# EAGLE design multi-pcb-cruisecontrol (EAGLE 9.6.2)
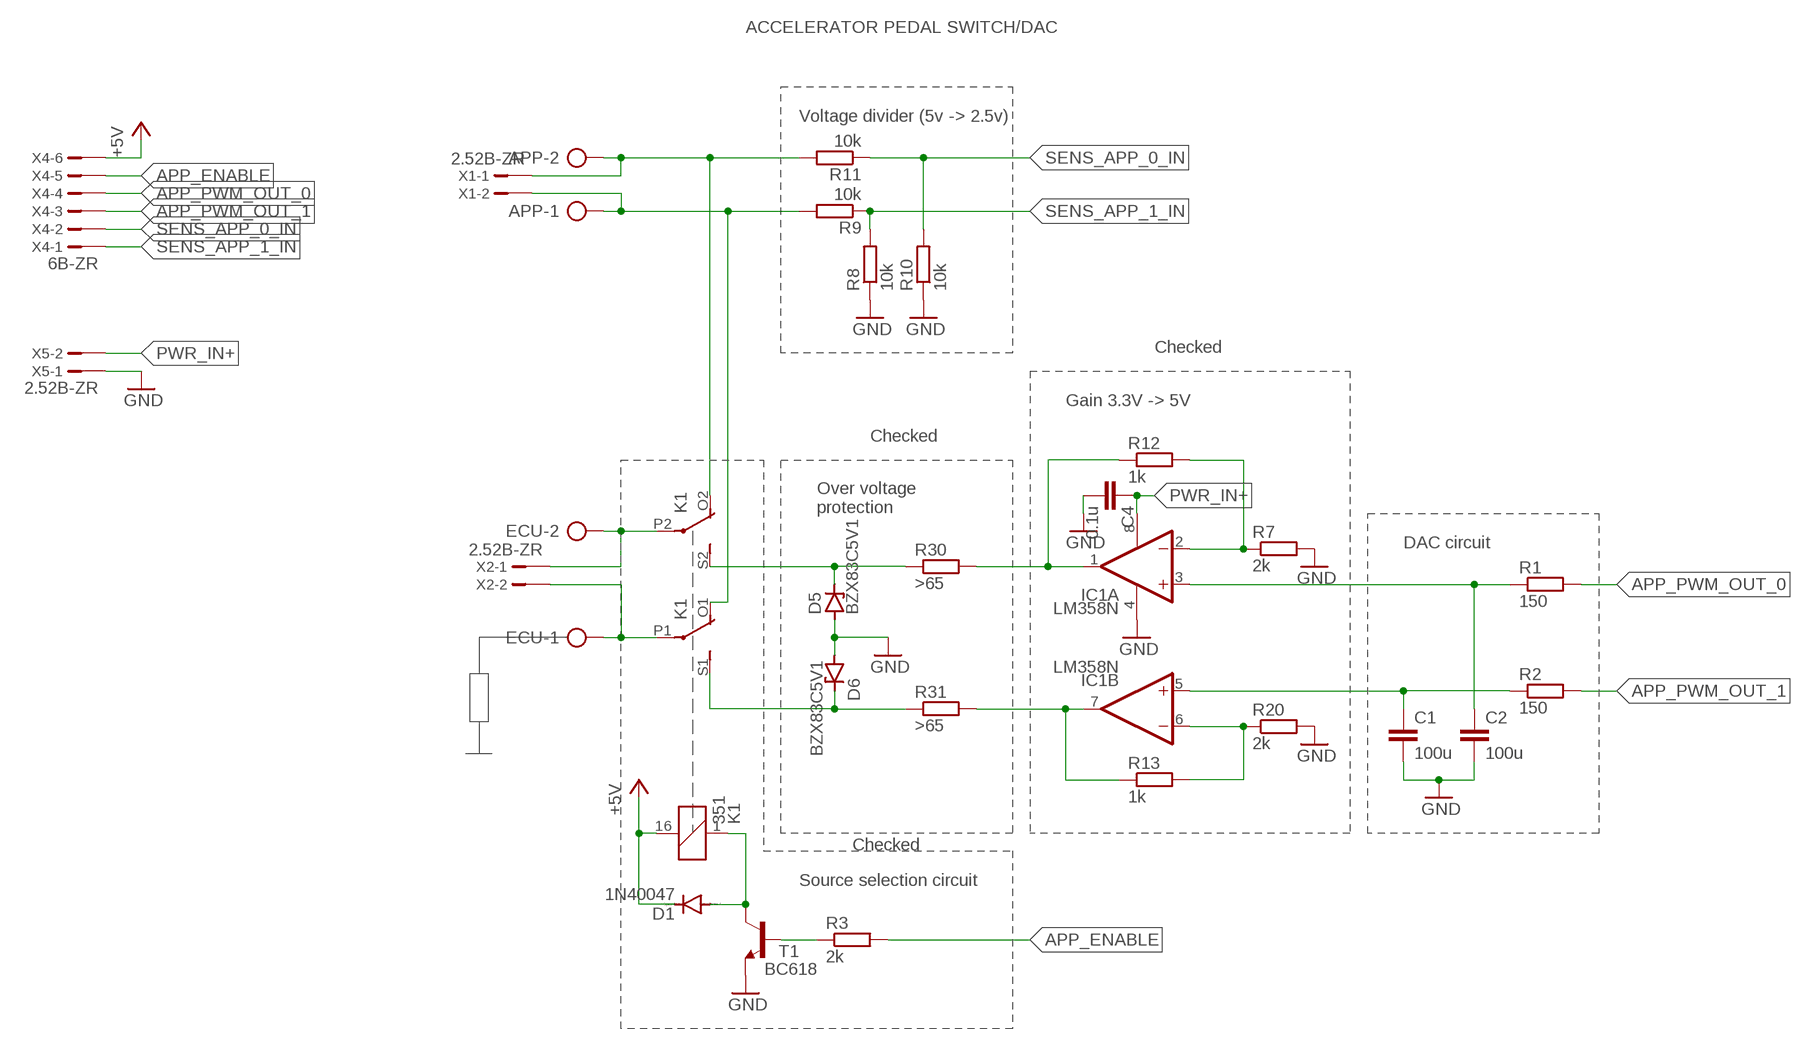
[diagram p0: schematic, sheet 1]

## Parts
APP  AK300/2  [AK300/2]
C1  100u  C-EU025-050X050  [C025-050X050]
C2  100u  C-EU025-050X050  [C025-050X050]
C4  0.1u  C-EU025-050X050  [C025-050X050]
D1  1N40047  [DO41-7.6]
D5  BZX83C5V1  BZX857  [DO41Z7.6]
D6  BZX83C5V1  BZX857  [DO41Z7.6]
ECU  AK300/2  [AK300/2]
IC1  LM358N  [DIL08]
K1  351  [351]
R1  150  R-EU_0207/7  [0207/7]
R2  150  R-EU_0207/7  [0207/7]
R3  2k  R-EU_0207/7  [0207/7]
R7  2k  R-EU_0207/7  [0207/7]
R8  10k  R-EU_0207/7  [0207/7]
R9  10k  R-EU_0207/7  [0207/7]
R10  10k  R-EU_0207/7  [0207/7]
R11  10k  R-EU_0207/7  [0207/7]
R12  1k  R-EU_0207/7  [0207/7]
R13  1k  R-EU_0207/7  [0207/7]
R20  2k  R-EU_0207/7  [0207/7]
R30  >65  R-EU_0207/7  [0207/7]
R31  >65  R-EU_0207/7  [0207/7]
T1  BC618  [TO92-EBC]
X1  2.52B-ZR  [B2B-ZR2.5]
X2  2.52B-ZR  [B2B-ZR2.5]
X4  6B-ZR  [B6B-ZR2.5]
X5  2.52B-ZR  [B2B-ZR2.5]

## Nets
+5V: D1.C K1.16 X4.6
APP_0_IN: APP.2 K1.O2(3:O) R11.2 X1.1
APP_1_IN: APP.1 K1.O1(2:O) R9.2 X1.2
APP_ENABLE: R3.2 X4.5
APP_PWM_OUT_0: R1.2 X4.4
APP_PWM_OUT_1: R2.2 X4.3
GND: C1.2 C2.2 C4.2 D5.A D6.A IC1.4(P:V-) R7.2 R8.1 R10.1 R20.2 T1.E X5.1
N$1: D1.A K1.1 T1.C
N$2: R3.1 T1.B
N$3: D6.C K1.S1(2:S) R31.1
N$4: IC1.1(A:OUT) R12.1 R30.2
N$6: ECU.2 K1.P2(3:P) X2.1
N$7: ECU.1 K1.P1(2:P) X2.2
N$8: C2.1 IC1.3(A:+IN) R1.1
N$9: C1.1 IC1.5(B:+IN) R2.1
N$13: IC1.2(A:-IN) R7.1 R12.2
N$16: IC1.6(B:-IN) R13.2 R20.1
N$17: D5.C K1.S2(3:S) R30.1
N$18: IC1.7(B:OUT) R13.1 R31.2
PWR_IN+: C4.1 IC1.8(P:V+) X5.2
SENS_APP_0_IN: R10.2 R11.1 X4.2
SENS_APP_1_IN: R8.2 R9.1 X4.1

## Notes on the sheet
- ACCELERATOR PEDAL SWITCH/DAC
- Voltage divider (5v -> 2.5v)
- Checked
- Gain 3.3V -> 5V
- Checked
- Over voltage
  protection
- DAC circuit
- Checked
- Source selection circuit

## Library data of the parts
APP ECU = con-ptr500-custom:AK300/2: CONNECTOR; OC_FARNELL: unknown; OC_NEWARK: unknown
C1 C2 C4 = rcl:C-EU: CAPACITOR, European symbol; SPICEPREFIX: C
D1 = diode-custom:1N4004: DIODE general purpose rectifier, 1 A
D5 D6 = diode-custom:BZX85: Z DIODE
IC1 = linear:LM358: OP AMP also LM158; LM258; LM2904 Source: http://cache.national.com/ds/LM/LM158.pdf
K1 = relay:351: RELAY 2 x switch, Omron; OC_FARNELL: unknown; OC_NEWARK: unknown
R1-R3 R7-R13 R20 R30 R31 = rcl:R-EU_: RESISTOR, European symbol; SPICEPREFIX: R
T1 = transistor-npn:BC618*: NPN Transistor
X1 X2 X5 = con-jst-custom:?2B-ZR: ZH CONNECTOR 1.5 mm, 4 pin 1 row Source: http://www.jst.com .. eZH.pdf
X4 = con-jst-custom:?6B-ZR: ZH CONNECTOR 1.5 mm, 4 pin 1 row Source: http://www.jst.com .. eZH.pdf

## Board
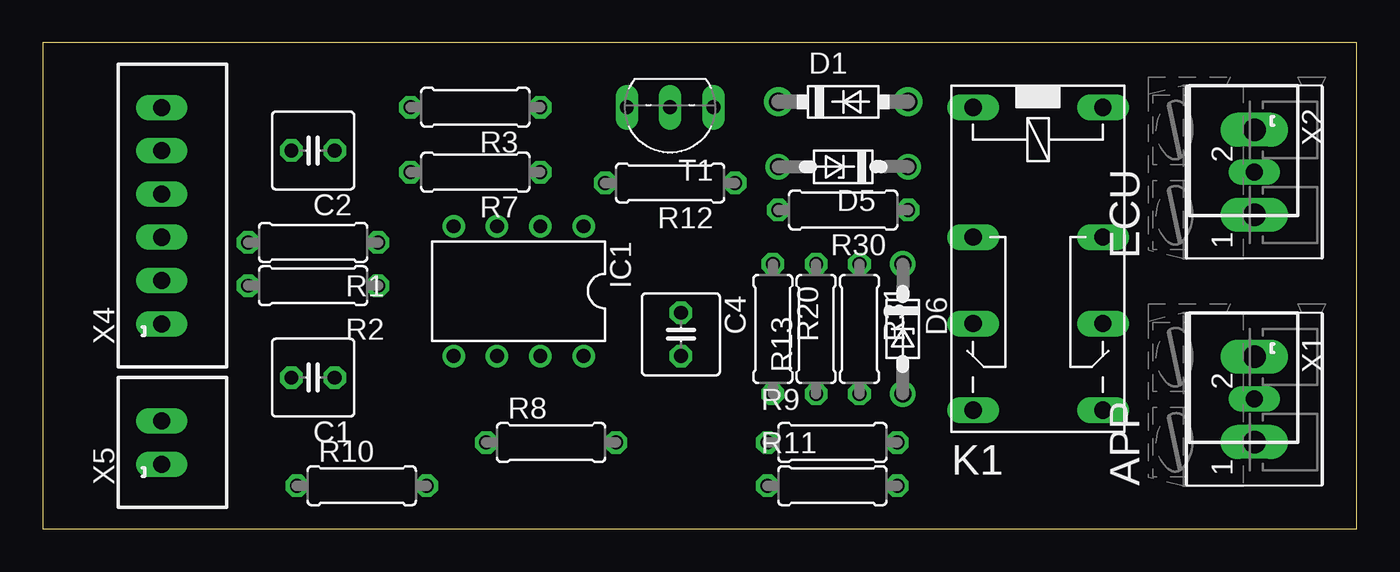
[diagram p1: board, top side]
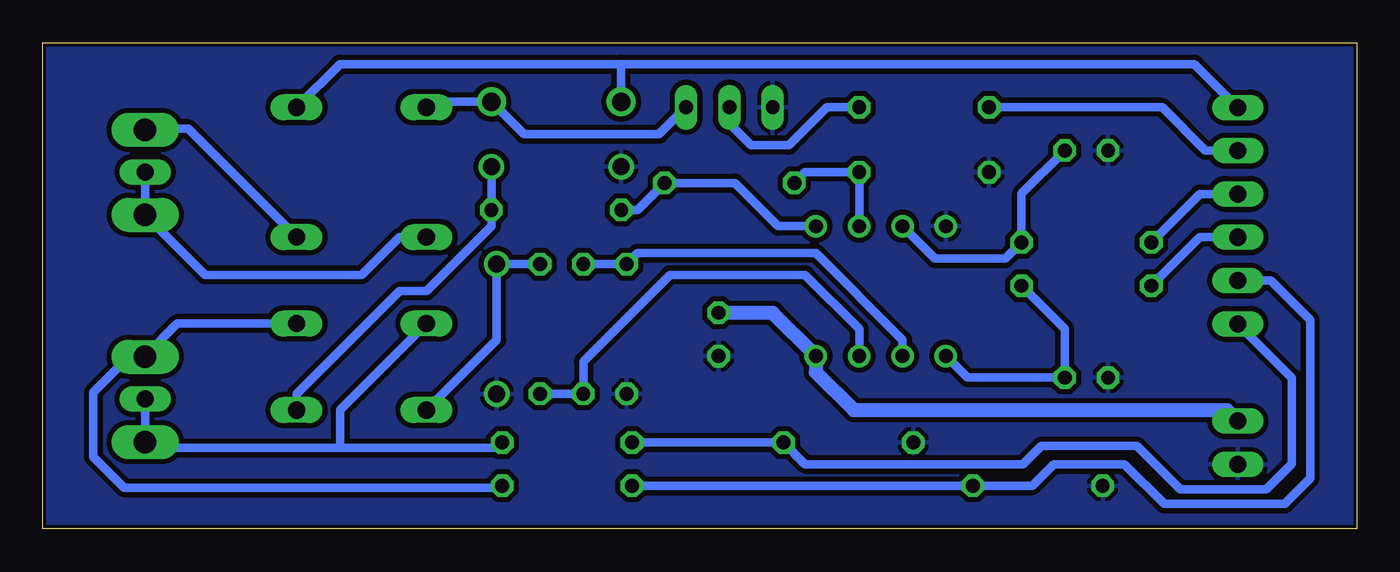
[diagram p2: board, bottom side, seen from below]

Size 77.14 x 28.57 mm. Coordinates in mm from the lower left corner, seen from the top.
Outline: 0,0 77.14,0 77.14,28.57 0,28.57 0,0
Copper layers (1*16): Top 0.035mm / dielectric 1.5mm / Bottom 0.035mm
Design rules "home-made-pcb": minimum track width 8mil, minimum drill 0.3mm, track to track 12mil, track to pad 8mil, pad to pad 10mil, via to via 10mil, smd to smd 6mil, copper to edge 8mil, drill to drill 10mil, minimum pad ring 10mil, minimum via ring 20mil, stop-mask expansion 4mil, vias tented up to drill 0mil, thermal gap 10mil

### Footprints (pad centres in the part's own frame; a part is rotated, then mirrored left to right if it is on the bottom)
AK300/2 = drill 1.321 long: 1 -2.515,0; 2 2.489,0
C025-050X050 = drill 0.813 octagon: 1 -1.27,0; 2 1.27,0
DO41-7.6 = drill 1.1 pad 1.7: A 3.81,0; C -3.81,0
DO41Z7.6 = drill 1: A 3.81,0; C -3.81,0
DIL08 = drill 0.813 pad 1.27: 1 -3.81,-3.81; 2 -1.27,-3.81; 3 1.27,-3.81; 4 3.81,-3.81; 5 3.81,3.81; 6 1.27,3.81; 7 -1.27,3.81; 8 -3.81,3.81
351 = drill 1.016 long: 1 -3.81,-3.81; 16 -3.81,3.81; O1 8.89,-3.81; O2 8.89,3.81; P1 3.81,-3.81; P2 3.81,3.81; S1 13.97,-3.81; S2 13.97,3.81
0207/7 = drill 0.813 octagon: 1 -3.81,0; 2 3.81,0
TO92-EBC = drill 0.813 long: B 0,-1.27; C -2.54,-1.27; E 2.54,-1.27
B2B-ZR2.5 = drill 1 pad 1.422 long: 1 -1.285,0; 2 1.257,0
B6B-ZR2.5 = drill 1 pad 1.422 long: 1 -6.365,0; 2 -3.823,0; 3 -1.283,0; 4 1.257,0; 5 3.797,0; 6 6.337,0

### Placement (x,y rotation side)
APP  71.12,7.62 90 top
C1  15.88,8.89 180 top
C2  15.88,22.23 180 top
C4  37.47,11.43 270 top
D1  46.99,25.08 0 top
D5  46.99,21.27 180 top
D6  50.48,11.75 270 top
ECU  71.12,20.95 90 top
IC1  27.94,13.97 180 top
K1  58.42,20.95 270 top
R1  15.88,16.83 180 top
R2  15.88,14.29 180 top
R3  25.4,24.77 180 top
R7  25.4,20.95 180 top
R8  29.84,5.08 0 top
R9  46.35,5.08 0 top
R10  18.73,2.54 0 top
R11  46.35,2.54 0 top
R12  36.83,20.32 180 top
R13  45.4,11.75 90 top
R20  42.86,11.75 270 top
R30  46.99,18.73 180 top
R31  47.94,11.75 270 top
T1  36.83,23.5 180 top
X1  71.12,8.89 270 top
X2  71.12,22.23 270 top
X4  6.99,18.41 90 top
X5  6.99,5.08 90 top

### Tracks (layer width: path | path; a pad name or v marks a point on that pad's centre or on a via)
+5V
  Bottom 0.508: K1.16 59.69,27.3 43.18,27.3 | X4.6 9.54,27.3 43.18,27.3 | D1.C 43.18,27.3
APP_0_IN
  Bottom 0.508: R11.2 50.28,2.43 72.35,2.43 74.17,4.24 74.17,8.01 72.07,10.11 APP.2 X1.1 69.23,12.06 K1.O2
APP_1_IN
  Bottom 0.508: X1.2 APP.1 70.78,4.76 59.69,4.76 | R9.2 50.48,4.76 59.69,4.76 | K1.O1 59.69,6.99 59.69,4.76
APP_ENABLE
  Bottom 0.508: X4.5 7,22.23 8.89,22.23 11.43,24.77 R3.2
APP_PWM_OUT_0
  Bottom 0.508: R1.2 9.22,19.67 X4.4
APP_PWM_OUT_1
  Bottom 0.508: R2.2 9.22,17.13 X4.3
GND
  pour Bottom: 0,28.57 0,0 77.47,0 77.47,28.57
N$1
  Bottom 0.508: K1.1 54.29,25.08 D1.A 48.9,23.18 40.96,23.18 T1.C
N$2
  Bottom 0.508: R3.1 31.11,24.77 33.34,22.54 35.56,22.54 36.83,23.81 T1.B
N$3
  Bottom 0.508: R31.1 D6.C 50.48,11.11 K1.S1
N$4
  Bottom 0.508: R30.2 42.23,18.73 R12.1 36.51,20.32 33.97,17.78 IC1.1
N$6
  Bottom 0.508: K1.P2 68.59,23.51 X2.1 ECU.2
N$7
  Bottom 0.508: K1.P1 56.2,17.14 58.42,14.92 67.6,14.92 ECU.1 X2.2
N$8
  Bottom 0.508: C2.1 19.68,19.68 R1.1 20.64,15.88 24.77,15.88 IC1.3
N$9
  Bottom 0.508: R2.1 17.14,11.75 C1.1 22.86,8.89 IC1.5
N$13
  Bottom 0.508: R12.2 32.38,20.95 R7.1 IC1.2
N$16
  Bottom 0.508: R13.2 R20.1 42.23,16.19 31.75,16.19 26.67,11.11 IC1.6
N$17
  Bottom 0.508: D5.C R30.1 50.8,17.78 54.61,13.97 56.2,13.97 62.23,7.94 K1.S2
N$18
  Bottom 0.508: IC1.7 29.21,11.75 32.38,14.92 40.32,14.92 45.4,9.84 R13.1 R31.2
PWR_IN+
  Bottom 0.813: X5.2 7.63,6.99 29.53,6.99 31.75,9.21 IC1.8 34.29,12.7 C4.1
SENS_APP_0_IN
  Bottom 0.508: R11.1 R10.2 19.05,2.54 17.78,3.81 13.65,3.81 11.32,1.47 4.24,1.47 2.74,2.97 2.74,12.27 5.07,14.59 X4.2
SENS_APP_1_IN
  Bottom 0.508: R9.1 R8.2 32.38,3.81 19.6,3.81 18.53,4.88 12.9,4.88 10.36,2.34 5.31,2.34 3.81,3.83 3.81,8.88 X4.1